# EAGLE schematic SerialController (EAGLE 9.6.1)
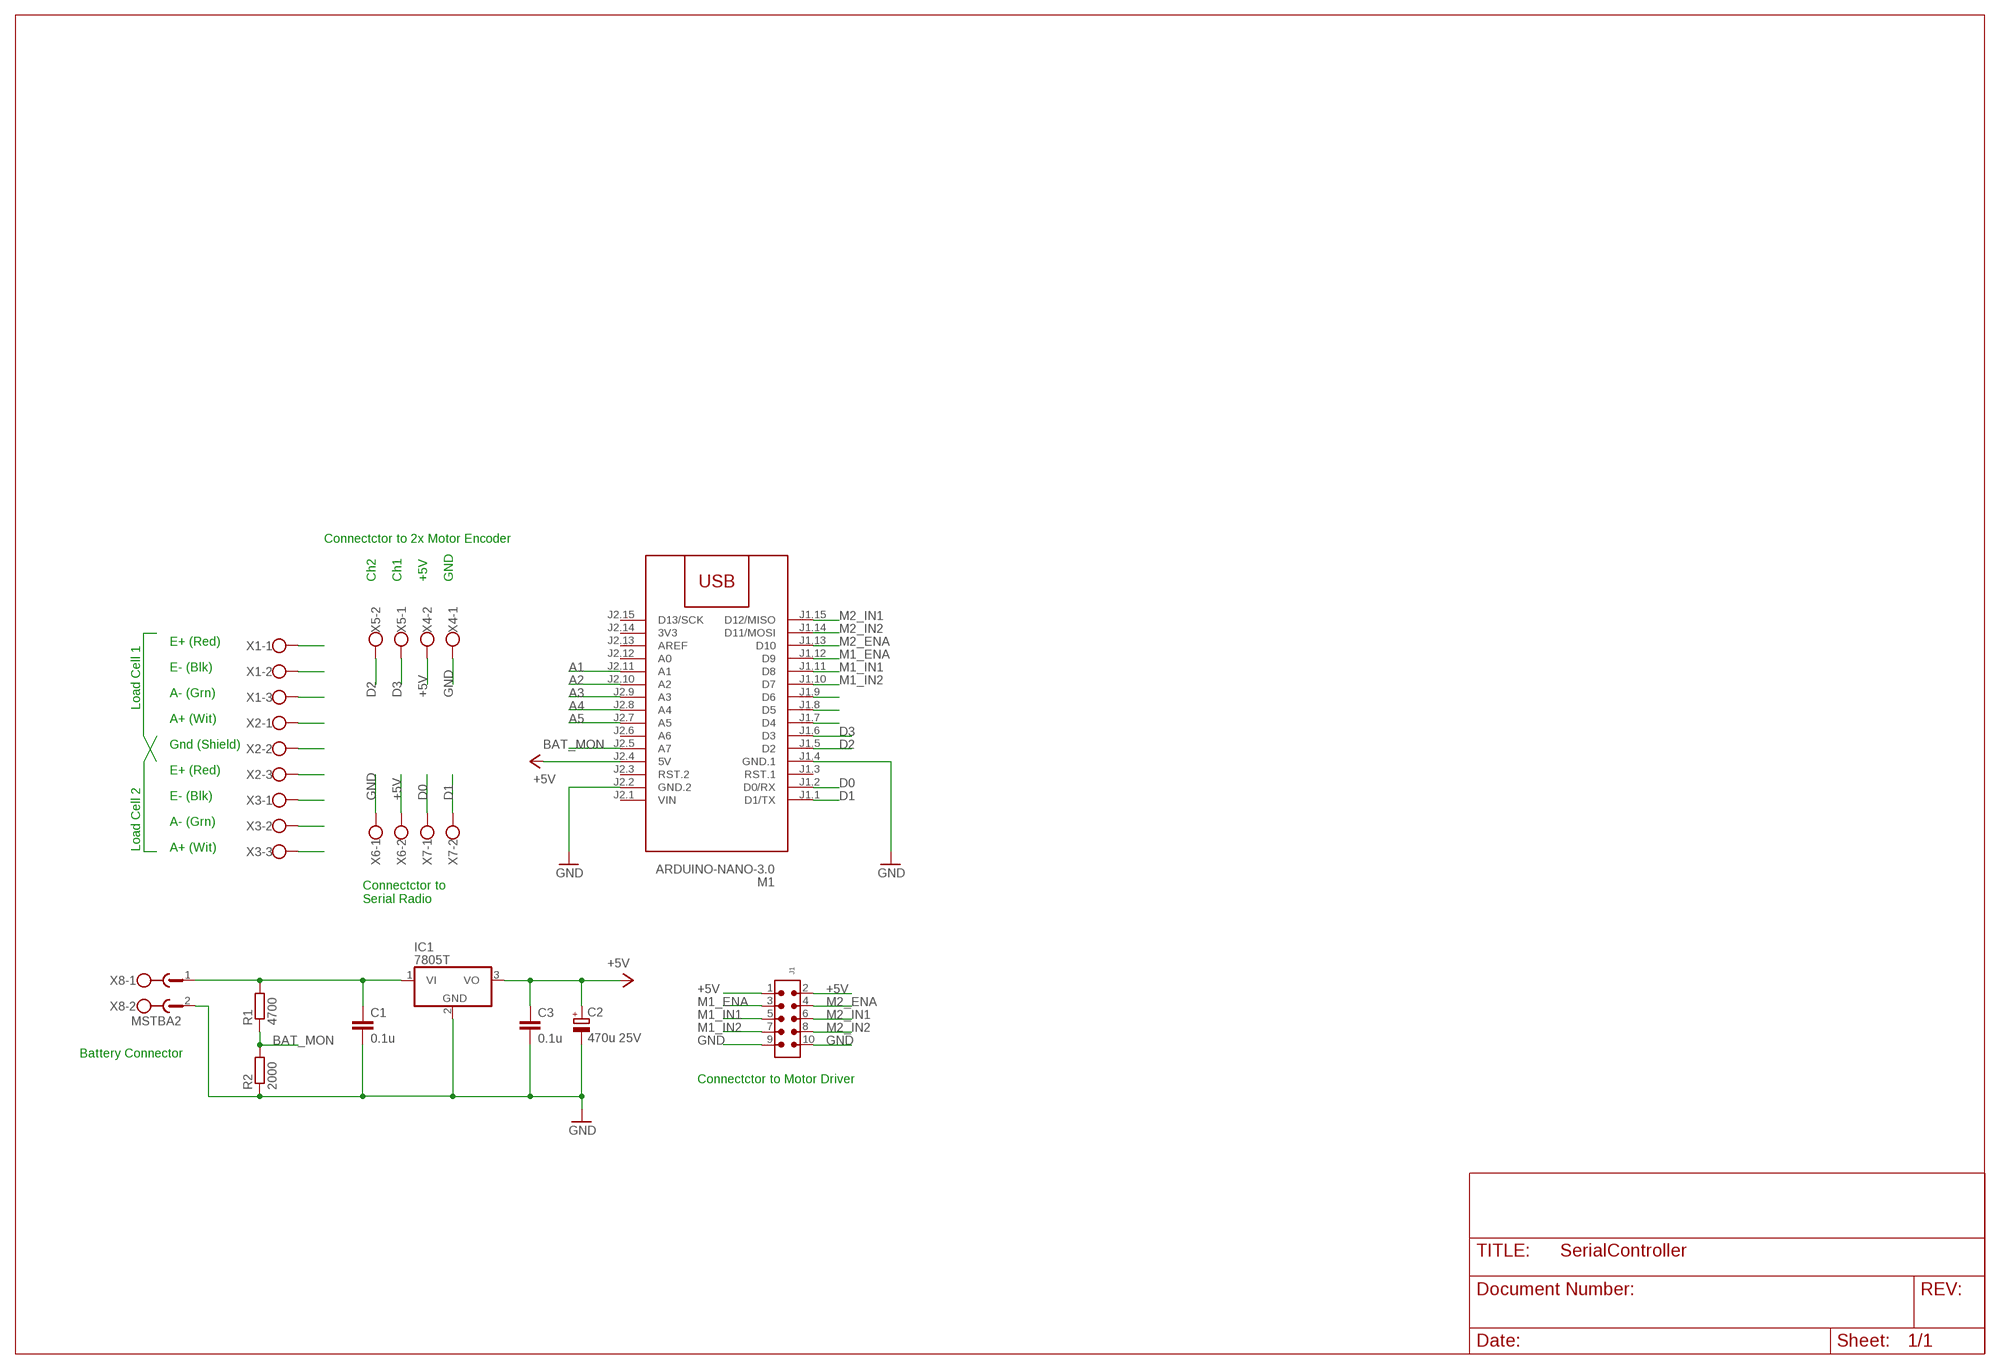
[diagram p0: schematic, sheet 1]

## Parts
C1  0.1u  C-EU050-030X075  [C050-030X075]
C2  470u 25V  CPOL-EUE10-20  [EB20D]
C3  0.1u  C-EU050-030X075  [C050-030X075]
IC1  7805T  [TO220H]
J1  6120XX21621_61201021621  [61201021621]
M1  ARDUINO-NANO-3.0  [ARDUINO-NANO-3.0]
R1  4700  R-EU_0207/12  [0207/12]
R2  2000  R-EU_0207/7  [0207/7]
X1  W237-103  [W237-103]
X2  W237-103  [W237-103]
X3  W237-103  [W237-103]
X4  W237-102  [W237-102]
X5  W237-102  [W237-102]
X6  W237-102  [W237-102]
X7  W237-102  [W237-102]
X8  MSTBA2  [MSTBA2]

## Nets
+5V: C2.+ C3.1 IC1.3(VO) J1.1 J1.2 M1.J2.4(5V) X4.2 X6.2
A1: M1.J2.11(A1)
A2: M1.J2.10(A2)
A3: M1.J2.9(A3)
A4: M1.J2.8(A4)
A5: M1.J2.7(A5)
BAT_MON: M1.J2.5(A7) R1.1 R2.2
D0: M1.J1.2(D0/RX) X7.1
D1: M1.J1.1(D1/TX) X7.2
D2: M1.J1.5(D2) X5.2
D3: M1.J1.6(D3) X5.1
GND: C1.2 C2.- C3.2 IC1.2(GND) J1.9 J1.10 M1.J1.4(GND.1) M1.J2.2(GND.2) R2.1 X4.1 X6.1 X8.2
M1_ENA: J1.3 M1.J1.12(D9)
M1_IN1: J1.5 M1.J1.11(D8)
M1_IN2: J1.7 M1.J1.10(D7)
M2_ENA: J1.4 M1.J1.13(D10)
M2_IN1: J1.6 M1.J1.15(D12/MISO)
M2_IN2: J1.8 M1.J1.14(D11/MOSI)
N$1: X1.1
N$2: X1.2
N$3: X1.3
N$4: X2.1
N$5: X2.2
N$6: X2.3
N$7: X3.1
N$8: X3.2
N$9: X3.3
N$10: C1.1 IC1.1(VI) R1.2 X8.1
N$13: M1.J1.9(D6)
N$14: M1.J1.8(D5)
N$15: M1.J1.7(D4)
Unconnected: M1.J1.3(RST.1) M1.J2.3(RST.2) M1.J2.6(A6) M1.J2.12(A0) M1.J2.13(AREF) M1.J2.15(D13/SCK)

## Notes on the sheet
- Connectctor to 2x Motor Encoder
- Ch2 | Ch1 | +5V | GND
- Load Cell 1 | E+ (Red)
- E- (Blk)
- A- (Grn)
- A+ (Wit)
- Gnd (Shield)
- E+ (Red)
- Load Cell 2
- E- (Blk)
- A- (Grn)
- A+ (Wit)
- Connectctor to
  Serial Radio
- Battery Connector
- Connectctor to Motor Driver

## Power pins joined to a net without a drawn wire
3V3: M1.J2.14(3V3)
VIN: M1.J2.1(VIN)

## Library data of the parts
C1 C3 = rcl:C-EU: CAPACITOR, European symbol; SPICEPREFIX: C
C2 = resistor:CPOL-EU: POLARIZED CAPACITOR, European symbol
IC1 = linear:78*: Positive VOLTAGE REGULATOR Source: http://cache.national.com/ds/LM/LM78L05.pdf http://www.fairchildsemi.com/ds/LM/LM7805.pdf
J1 = Wurth_Connectors_WR-BHD:6120XX21621_61201021621: WR-BHD 2.54 mm Male Box Header KIND PROPERTIES: Pitch 2.54 mm Gender:Male MATERIAL PROPERTIES: Insulator Material:PBT Insulator Flammability Rating UL94 V-0 Insulator Color:Black Contact Material :Copper Alloy Contact Plating :Gold Contact Type: Stamped GENERAL INFORMATION: Operating Temperature:-40 °C up to +125 °C Compliance:RoHS Working Voltage: 250 V (AC) Withstanding Voltage:500 V (AC) Contact Resistance: 20 mΩ Insulation Resistance:1000 MΩ CERTIFICATION: UL Approval:E323964 PACKAGING PROPERTIES Packaging :Tray <https://katalog.we-online.com/media/images/v2/o32884v209%20Family_WR-BHD_6120xx21621.jpg> Details see: https://katalog.we-online.com/en/em/BHD_2_54_MALE_BOX_HEADER_6120XX21621 Updated by Yingchun,Shan 2019-10-29 2019 (C) Würth Elektronik; CONTACT-RESISTANCE: 20mOhm; DATASHEET-URL: https://katalog.we-online.com/em/datasheet/61201021621.pdf; GENDER: Male; IR: 3A; L: 20.36mm; MATES: WR-BHD 2.54mm Female IDC Connector with Strain Relief; MOUNT: THT; PACKAGING: Tray; PART-NUMBER: 61201021621; PINS: 10; PITCH: 2.54mm; TOL-R: max.; TYPE: Straight; WORKING-VOLTAGE: 250V(AC)
M1 = diy-modules:ARDUINO-NANO-3.0: Arduino Nano 3.0 and compatible devices More details available here: https://www.arduino.cc/en/Main/ArduinoBoardNano Click here to find device on ebay.com <http://www.ebay.com/sch/arduino+nano>
R1 R2 = resistor:R-EU_: RESISTOR, European symbol
X1-X3 = con-wago-500:W237-103: WAGO SCREW CLAMP; MPN: 237-103; OC_FARNELL: unknown; OC_NEWARK: 18M7116
X4-X7 = con-wago-500:W237-102: WAGO SCREW CLAMP; MPN: 237-102; OC_FARNELL: unknown; OC_NEWARK: 70K9898
X8 = con-phoenix-508:MSTBA2: PHOENIX; MF: FARNELL; MPN: 1757242; OC_FARNELL: 3705171; OC_NEWARK: 71C4161